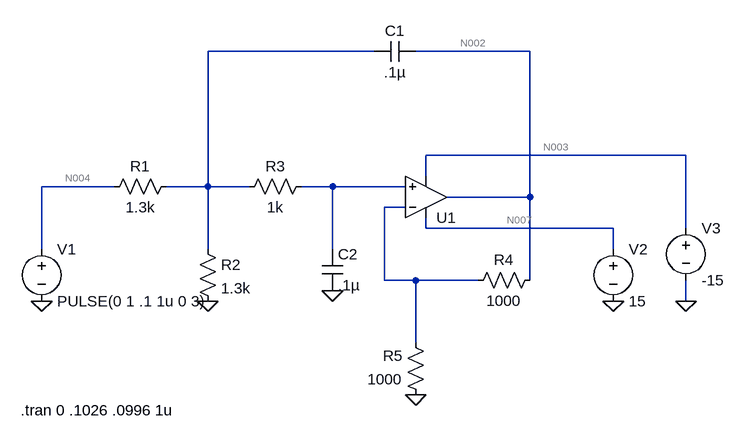
[diagram p0: schematic LTSpice Schematic OpAmp6.asc]
LTSpice Schematic OpAmp6.asc, the LTspice schematic file:
Version 4
SHEET 1 1084 680
WIRE 544 -176 288 -176
WIRE 784 -176 608 -176
WIRE 1024 -16 624 -16
WIRE 624 16 624 -16
WIRE 144 32 32 32
WIRE 288 32 288 -176
WIRE 288 32 224 32
WIRE 352 32 288 32
WIRE 480 32 432 32
WIRE 592 32 480 32
WIRE 784 48 784 -176
WIRE 784 48 656 48
WIRE 592 64 560 64
WIRE 624 96 624 80
WIRE 912 96 624 96
WIRE 1024 96 1024 -16
WIRE 32 128 32 32
WIRE 288 128 288 32
WIRE 480 128 480 32
WIRE 912 128 912 96
WIRE 560 176 560 64
WIRE 608 176 560 176
WIRE 704 176 608 176
WIRE 784 176 784 48
WIRE 1024 208 1024 176
WIRE 608 272 608 176
FLAG 608 352 0
FLAG 480 192 0
FLAG 288 208 0
FLAG 32 208 0
FLAG 912 208 0
FLAG 1024 208 0
SYMBOL voltage 32 112 R0
WINDOW 123 0 0 Left 2
WINDOW 39 0 0 Left 2
SYMATTR InstName V1
SYMATTR Value PULSE(0 1 .1 1u 0 3)
SYMBOL res 128 48 R270
WINDOW 0 32 56 VTop 2
WINDOW 3 0 56 VBottom 2
SYMATTR InstName R1
SYMATTR Value 1.3k
SYMBOL res 336 48 R270
WINDOW 0 32 56 VTop 2
WINDOW 3 0 56 VBottom 2
SYMATTR InstName R3
SYMATTR Value 1k
SYMBOL res 272 112 R0
SYMATTR InstName R2
SYMATTR Value 1.3k
SYMBOL res 800 160 R90
WINDOW 0 0 56 VBottom 2
WINDOW 3 32 56 VTop 2
SYMATTR InstName R4
SYMATTR Value 1000
SYMBOL res 624 368 R180
WINDOW 0 36 76 Left 2
WINDOW 3 36 40 Left 2
SYMATTR InstName R5
SYMATTR Value 1000
SYMBOL cap 464 128 R0
SYMATTR InstName C2
SYMATTR Value .1µ
SYMBOL cap 608 -192 R90
WINDOW 0 0 32 VBottom 2
WINDOW 3 32 32 VTop 2
SYMATTR InstName C1
SYMATTR Value .1µ
SYMBOL voltage 912 112 R0
WINDOW 123 0 0 Left 2
WINDOW 39 0 0 Left 2
SYMATTR InstName V2
SYMATTR Value 15
SYMBOL Opamps\\UniversalOpamp2 624 48 M180
SYMATTR InstName U1
SYMBOL voltage 1024 80 R0
WINDOW 123 0 0 Left 2
WINDOW 39 0 0 Left 2
SYMATTR InstName V3
SYMATTR Value -15
TEXT 0 376 Left 2 !.tran 0 .1026 .0996 1u

The netlist it stands for:
* LTSpice Schematic OpAmp6.asc
V1 N004 0 PULSE(0 1 .1 1u 0 3)
R1 N004 N001 1.3k
R3 N001 N005 1k
R2 N001 0 1.3k
R4 N002 N006 1000
R5 0 N006 1000
C2 N005 0 .1µ
C1 N002 N001 .1µ
V2 N007 0 15
XU1 N005 N006 N007 N003 N002 level.2 Avol=1Meg GBW=10Meg Slew=10Meg ilimit=25m rail=0 Vos=0 phimargin=45 en=0 enk=0 in=0 ink=0 Rin=500Meg  ; pins IN+ IN- V+ V- OUT
V3 N003 0 -15
.tran 0 .1026 .0996 1u
.lib UniversalOpamps2.sub
.backanno
.end

* Results of the author's LTspice run, read from the files saved beside the schematic
* Operating Point, zero values left out:
*   V(n007) = 15 V
*   V(n003) = -15 V
*   I(V3) = 1.498 mA
*   I(V2) = -1.498 mA
*   Ix(u1:3) = 1.498 mA
*   Ix(u1:4) = -1.498 mA
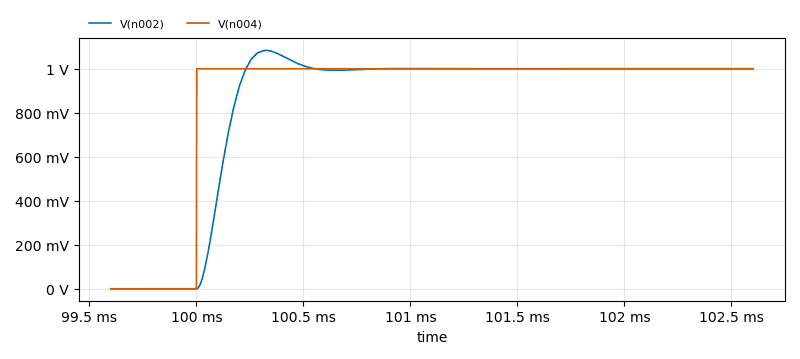
[diagram p1: Transient Analysis of LTSpice Schematic OpAmp6.asc, plotted from the saved traces]
* Transient Analysis, 1 run:
*   V(n002): min 0 V, max 1.084 V, average 833 mV, rms 909.5 mV, last 1 V
*   V(n004): min 0 V, max 1 V, average 866.5 mV, rms 930.8 mV, last 1 V